# Altium schematic sheet Battery Charger.SchDoc
size A4; SheetNumber: 2; SheetTotal: 3
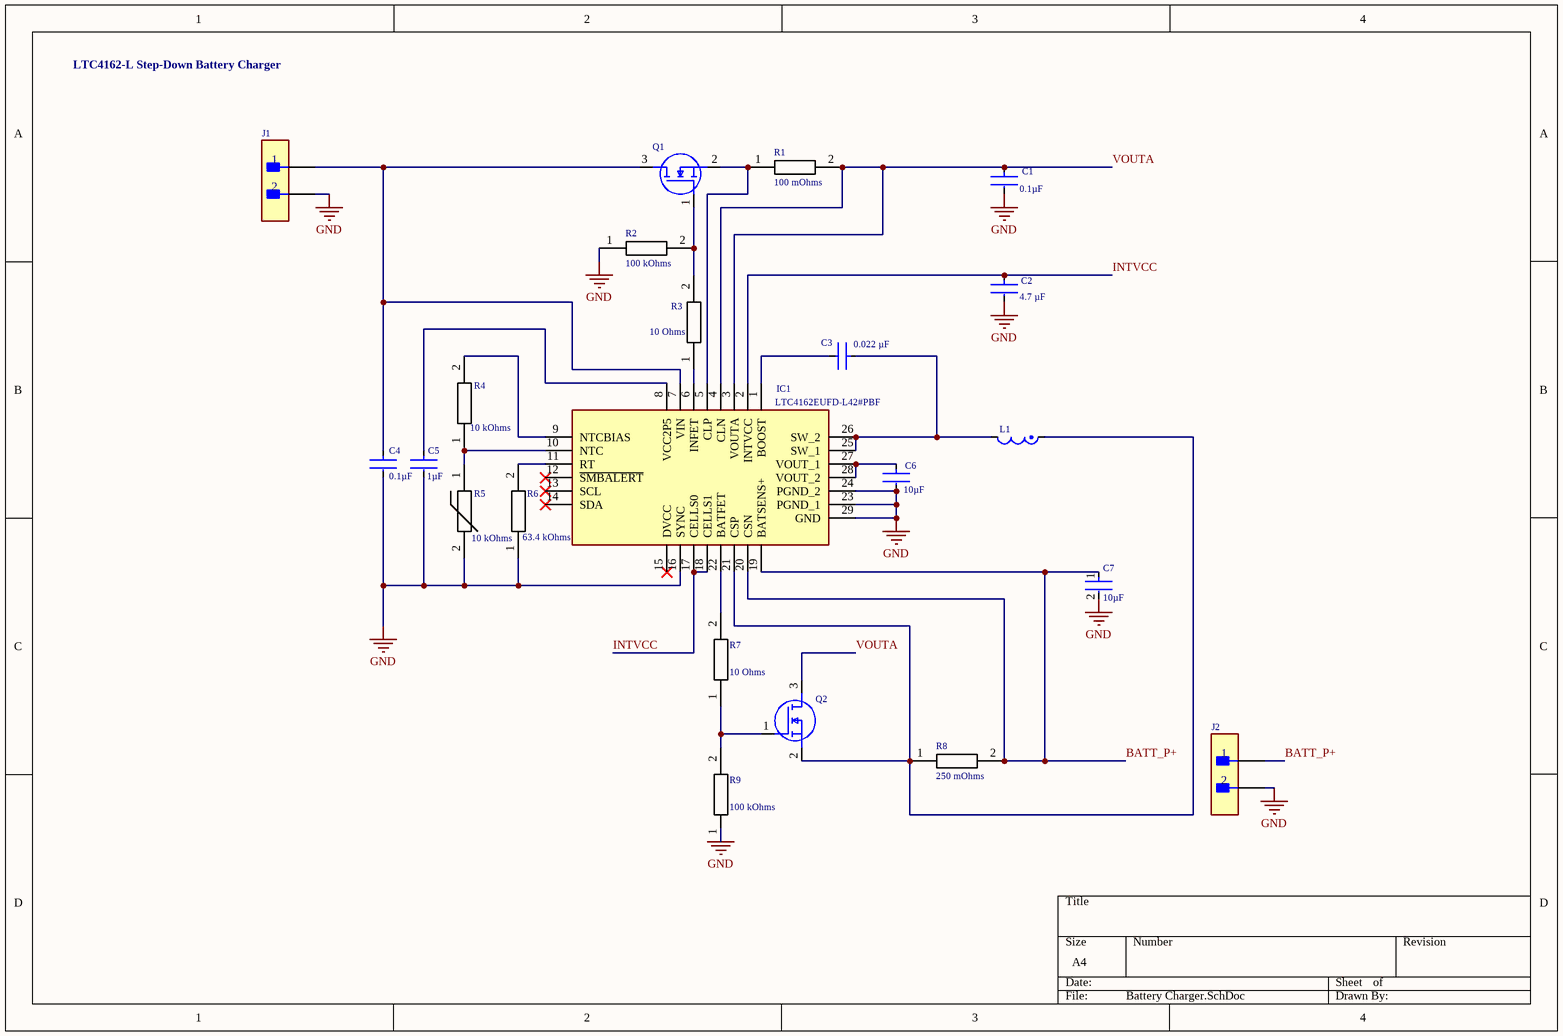
[diagram p0: Battery Charger.SchDoc]

## Parts
C1  0.1µF  [FP-CC0603-DA-MFG]
C2  4.7 µF  [FP-CC0603-DA-MFG]
C3  0.022 µF  [FP-C0603C-CF-MFG]
C4  0.1µF  [FP-CC0603-DA-MFG]
C5  1µF  [FP-CC0603-DA-MFG]
C6  10µF  [FP-GRM21B-0_1-MFG]
C7  10µF  [FP-GRM21B-0_1-MFG]
IC1  LTC4162EUFD-L42#PBF  [QFN50P400X500X80-29N-D]
J1  B2B-XH-A(LF)(SN)  [FP-B2B-XH-A_LF_SN-MFG]  (value not drawn)
J2  B2B-XH-A(LF)(SN)  [FP-B2B-XH-A_LF_SN-MFG]  (value not drawn)
L1  #B952AS-H-1R1N=P3  [FP-DS104C2-MFG]  (value not drawn)
Q1  IRLML6344TRPBF  [SOT95P237X112-3N]  (value not drawn)
Q2  IRLML6344TRPBF  [SOT95P237X112-3N]  (value not drawn)
R1  100 mOhms  [WSL2512R1000FEA Resistor]
R2  100 kOhms  [RC0603FR-07100KL Resistor]
R3  10 Ohms  [RC0603FR-0710RL Resistor]
R4  10 kOhms  [RC0603FR-0710KL]
R5  10 kOhms  [NCP18XH103F03RB]
R6  63.4 kOhms  [RESC1608X55N]
R7  10 Ohms  [RC0603FR-0710RL Resistor]
R8  250 mOhms  [RESC3216X89N]
R9  100 kOhms  [RC0603FR-07100KL Resistor]

## Nets
GND: C1.2 C2.2 C4.2 C5.2 C6.2 C7.2 IC1.16(SYNC) IC1.23(PGND_1) IC1.24(PGND_2) IC1.29(GND) J1.2 J2.2 R2.1 R5.2 R6.1 R9.1
BATT_P+: C7.1 IC1.19(BATSENS+) IC1.20(CSN) J2.1 R8.2
INTVCC: C2.1 IC1.2(INTVCC) IC1.17(CELLS0) IC1.18(CELLS1)
VOUTA: C1.1 IC1.3(VOUTA) IC1.4(CLN) Q2.3(D) R1.2
NetC3_1: C3.1 IC1.25(SW_1) IC1.26(SW_2) L1.2
NetC3_2: C3.2 IC1.1(BOOST)
NetC4_1: C4.1 IC1.7(VIN) J1.1 Q1.3(D)
NetC5_1: C5.1 IC1.8(VCC2P5)
NetC6_1: C6.1 IC1.27(VOUT_1) IC1.28(VOUT_2)
NetIC1_5: IC1.5(CLP) Q1.2(S) R1.1
NetIC1_6: IC1.6(INFET) R3.1
NetIC1_9: IC1.9(NTCBIAS) R4.2
NetIC1_10: IC1.10(NTC) R4.1 R5.1
NetIC1_11: IC1.11(RT) R6.2
NetIC1_21: IC1.21(CSP) L1.1 Q2.2(S) R8.1
NetIC1_22: IC1.22(BATFET) R7.2
NetQ1_1: Q1.1(G) R2.2 R3.2
NetQ2_1: Q2.1(G) R7.1 R9.2

Not connected (* = marked no-connect by the designer): IC1 12(~{SMBALERT})* 13(SCL)* 14(SDA)* 15(DVCC)*

## Notes on the sheet
- LTC4162-L Step-Down Battery Charger

## Library data of the parts
C1 C4 = CMP-2000-05002-2: CAP CER 0.1UF 16V X7R 0603 CC0603KRX7R7BB104; Manufacturer: YAGEO; Tolerance: 0.1; Value: 100 nF; Temperature Coefficient: 15%; Material: Ceramic; Voltage Rating: 16 V; Package: CC0603-DA; ComponentLink2Description: Datasheet; Octopart: https://octopart.com/cc0603krx7r7bb104-yageo-192941; Temperature Range High: +125°C; Digikey Description: CAP CER 0.1UF 16V X7R 0603; Voltage: 16 V; Device Class L2: Capacitors; Height: 0.9mm; Temperature: -55°C to +125°C; Manufacturer Part Number: CC0603KRX7R7BB104; Device Class L1: Passive Components; Device Class L3: Ceramic Capacitors; ComponentLink2URL: http://www.yageo.com/documents/recent/UPY-GPHC_X7R_6.3V-to-50V_18.pdf; Footprint Url: http://www.yageo.com/exep/pages/download/literatures/UPY-C_GEN_24.pdf; RoHS: TRUE; Temperature Range Low: -55°C; Temperature Characteristic: X7R; Lead Free: Yes; Capacitance: 100 nF; Category: Cap; Mouser Description: Multilayer Ceramic Capacitor, CC Series, 0.1 - F, - 10%, X7R, 16 V, 0603 [1608 Metric]; Automotive: No
C2 = CMP-2000-06074-2: CAP CER 4.7UF 10V X5R 0603 CC0603KRX5R6BB475; Manufacturer: YAGEO; Temperature Coefficient: 15%; Tolerance: 0.1; Material: Ceramic; Voltage Rating: 10 V; ComponentLink2URL: http://www.yageo.com/documents/recent/UPY-GPHC_X7R_6.3V-to-50V_18.pdf; Package: CC0603-DA; Temperature Range High: +125°C; Category: Cap; ComponentLink2Description: Datasheet; Lead Free: Yes; Mouser Description: 4.7µF Surface Mount, MLCC 0603 (1608 Metric) Package Ceramic Capacitors; Manufacturer Part Number: CC0603KRX5R6BB475; Device Class L2: Capacitors; Temperature Characteristic: X5R; Voltage: 10 V; RoHS: TRUE; Octopart: https://octopart.com/cc0603krx5r6bb475-yageo-9292507; Automotive: No; Height: 0.9mm; Temperature: -55°C to +125°C; Temperature Range Low: -55°C; Value: 4.7 uF; Digikey Description: CAP CER 4.7UF 10V X5R 0603; Device Class L1: Passive Components; Capacitance: 4.7 uF; Footprint Url: http://www.yageo.com/exep/pages/download/literatures/UPY-C_GEN_24.pdf; Device Class L3: Ceramic Capacitors
C3 = CMP-2006-03139-2: Ceramic Capacitor 0.022Uf 16V, X7R, 10%, 0603, Full Reel C0603C223K4RACTU; Manufacturer: KEMET; Capacitance: 22,000 pF; Temperature Coefficient: 30ppm/°C; Automotive Grade: Grade 1; Value: 22,000 pF; Tolerance: 0.1; Category: Cap; RoHS: TRUE; Temperature Range High: +125°C; Octopart: https://octopart.com/c0603c223k4ractu-kemet-123286; Manufacturer Part Number: C0603C223K4RACTU; Mouser Description: CAP CER 0.022UF 16V X7R 0603; Voltage Rating: 16 V; Device Class L1: Passive Components; Automotive: Yes; Height: 0.87mm; Device Class L3: Ceramic Capacitors; Package: C0603C-CF; Temperature Characteristic: X7R; Device Class L2: Capacitors; Material: Ceramic; Lead Free: Yes; ComponentLink2URL: https://api.kemet.com/component-edge/download/datasheet/C0603C100J5GACAUTO.pdf; Temperature Range Low: -55°C; Digikey Description: Ceramic Capacitor 0.022Uf 16V, X7R, 10%, 0603, Full Reel; Temperature: -55°C to +125°C; ComponentLink2Description: Datasheet
C5 = CMP-03422-000612-1: CAP CER 1UF 25V X5R 0603 CC0603KRX5R8BB105; Manufacturer: YAGEO; Material: Ceramic; Tolerance: 0.1; Temperature Coefficient: 15%; Automotive: No; Octopart: https://octopart.com/cc0603krx5r8bb105-yageo-9292811; Package: CC0603-DA; Temperature Range High: +125°C; Digikey Description: CAP CER 1UF 25V X5R 0603; Mouser Description: Multilayer Ceramic Capacitors MLCC - SMD/SMT 1.0uF 25V X5R 10%; Device Class L2: Capacitors; Category: Cap; Value: 1 uF; Temperature: -55°C to +125°C; ComponentLink2URL: http://www.yageo.com/documents/recent/UPY-GPHC_X7R_6.3V-to-50V_18.pdf; Capacitance: 1 uF; ComponentLink2Description: Datasheet; Voltage: 25 V; Manufacturer Part Number: CC0603KRX5R8BB105; Height: 0.9mm; Device Class L3: Ceramic Capacitors; Temperature Characteristic: X5R; Footprint Url: http://www.yageo.com/exep/pages/download/literatures/UPY-C_GEN_24.pdf; Temperature Range Low: -55°C; Device Class L1: Passive Components; Voltage Rating: 25 V; Lead Free: Yes; RoHS: TRUE
C6 C7 = CMP-2007-03534-2: Chip Multilayer Ceramic Capacitors for General Purpose, 0805, 10uF, X5R, 15%, 10%, 16V GRM21BR61C106KE15K; Case Code (Imperial): 0805; Packaging: Tape and Reel; Width: 0.049inch; Depth: 1.25mm; Voltage Rating: 16V; Height: 1.25mm; Case/Package: 0805; Max Operating Temperature: 85°C; Min Operating Temperature: -55°C; Tolerance: 10%; Dielectric: X5R; REACH SVHC: No SVHC; Mount: Surface Mount; Radiation Hardening: No; Case Code (Metric): 2012; Length: 2mm; Package Quantity: 10000; Voltage Rating (DC): 16V; Voltage: 16V; Capacitance: 10uF; Thickness: 0.053inch; Termination: SMD/SMT
IC1 = LTC4162EUFD-L42#PBF: Integrated Circuit; Manufacturer_Name: Analog Devices; Datasheet Link: https://www.analog.com/media/en/technical-documentation/data-sheets/LTC4162-L.pdf; Height: 0.8mm; Manufacturer_Part_Number: LTC4162EUFD-L42#PBF; Mouser Part Number: 584-4162EUFDL42PB; Mouser Price/Stock: https://www.mouser.co.uk/ProductDetail/Analog-Devices/LTC4162EUFD-L42PBF?qs=MLItCLRbWsz3JPFW5UIzwg%3D%3D; Arrow Part Number: LTC4162EUFD-L42#PBF; Arrow Price/Stock: https://www.arrow.com/en/products/ltc4162eufd-l42pbf/analog-devices?region=nac
J1 J2 = CMP-2000-05888-3: CONN HEADER VERT 2POS 2.5MM; Current Rating: 3A; Voltage Rating: 250V; Number of Contacts: 2; Contact Resistance: 20mR; Wire/Cable Gauge: 22AWG; Insulation Resistance: 1GR; Connector Type: Male Pin; Packaging: Bulk; Contact Material: Brass; Lead Free: Lead Free; Orientation: Straight; Contact Plating: Tin; Max Current Rating: 3A; Termination: Solder; Fastening Type: Detent; Depth: 5.75mm; Housing Material: Polyamide; REACH SVHC: No SVHC; Series: XH; Voltage Rating (AC): 250V; Number of Positions: 2; Color: Natural; Contact Type: Male Pin; Max Voltage Rating (DC): 250V; Pitch: 2.5mm; Lead Pitch: 2.5mm; Mount: Through Hole; Max Operating Temperature: 85°C; Length: 7.4mm; Max Voltage Rating (AC): 250V; Min Operating Temperature: -25°C; Number of Rows: 1; Housing Color: White
L1 = CMP-06042-014464-1: Shielded Wirewound Inductor 1.1uH 30% 6000mA 0.011Ω SMD; Saturation Current: 11.7A; Test Frequency: 100kHz; DC Resistance (DCR): 11mR; Core Material: Ferrite; Current Rating: 6A; Mount: Surface Mount; Max Operating Temperature: 85°C; Shielding: Shielded; Tolerance: 30%; Length: 0.409inch; Packaging: Tape and Reel; Inductance: 1.1uH; Case/Package: Nonstandard; Resistor Type: Wirewound; Min Operating Temperature: -40°C; Width: 0.409inch; Height - Seated (Max): 0.19inch
Q1 Q2 = IRLML6344TRPBF: MOSFET (N-Channel); Manufacturer_Name: Infineon; Datasheet Link: https://www.infineon.com/dgdl/irlml6344pbf.pdf?fileId=5546d462533600a4015356689c44262c; Height: 1.12mm; Manufacturer_Part_Number: IRLML6344TRPBF; Mouser Part Number: 942-IRLML6344TRPBF; Mouser Price/Stock: https://www.mouser.co.uk/ProductDetail/Infineon-Technologies/IRLML6344TRPBF?qs=9%252BKlkBgLFf2w4qS48UOXVw%3D%3D; Arrow Part Number: IRLML6344TRPBF; Arrow Price/Stock: https://www.arrow.com/en/products/irlml6344trpbf/infineon-technologies-ag?utm_currency=USD&region=nac
R1 = WSL2512R1000FEA Resistor: 100 mOhms ±1% 1W Chip Resistor 2512 (6432 Metric) Anti-Sulfur, Automotive AEC-Q200, Current Sense, Moisture Resistant, Pulse Withstanding Metal Element
R2 R9 = RC0603FR-07100KL Resistor: 100 kOhms ±1% 0.1W, 1/10W Chip Resistor 0603 (1608 Metric) Moisture Resistant Thick Film
R3 R7 = RC0603FR-0710RL Resistor: 10 Ohms ±1% 0.1W, 1/10W Chip Resistor 0603 (1608 Metric) Moisture Resistant Thick Film
R4 = RC0603FR-0710KL Resistor: 10 kOhms ±1% 0.1W, 1/10W Chip Resistor 0603 (1608 Metric) Moisture Resistant Thick Film
R5 = NCP18XH103F03RB Resistor: THERMISTOR NTC 10KOHM 3380K 0603
R6 = RC0603FR-0763K4L: Manufacturer_Name: KEMET; Datasheet Link: http://www.yageo.com/documents/recent/PYu-RC0603_51_RoHS_L_v5.pdf; Height: 0.55mm; Manufacturer_Part_Number: RC0603FR-0763K4L; Mouser Part Number: 603-RC0603FR-0763K4L; Mouser Price/Stock: https://www.mouser.co.uk/ProductDetail/Yageo/RC0603FR-0763K4L?qs=bK2T7AVO1ye5WfXmb5QR%252Bw%3D%3D; Arrow Part Number: RC0603FR-0763K4L; Arrow Price/Stock: https://www.arrow.com/en/products/rc0603fr-0763k4l/yageo
R8 = WSL1206R2500FEA: Manufacturer_Name: Vishay; Datasheet Link: https://www.mouser.in/datasheet/2/427/wslhigh-1762363.pdf; Height: 0.889mm; Manufacturer_Part_Number: WSL1206R2500FEA; Mouser Part Number: 71-WSL1206R2500FEA; Mouser Price/Stock: https://www.mouser.co.uk/ProductDetail/Vishay-Dale/WSL1206R2500FEA?qs=fncU5wK7Cm8cLM%252BaCMrFvQ%3D%3D